# EAGLE design Adafruit Feather ESP32-S2 (EAGLE 9.6.2)
COMPANY: ADAFRUIT INDUSTRIES; DRAWN: KTOWN; REV: B
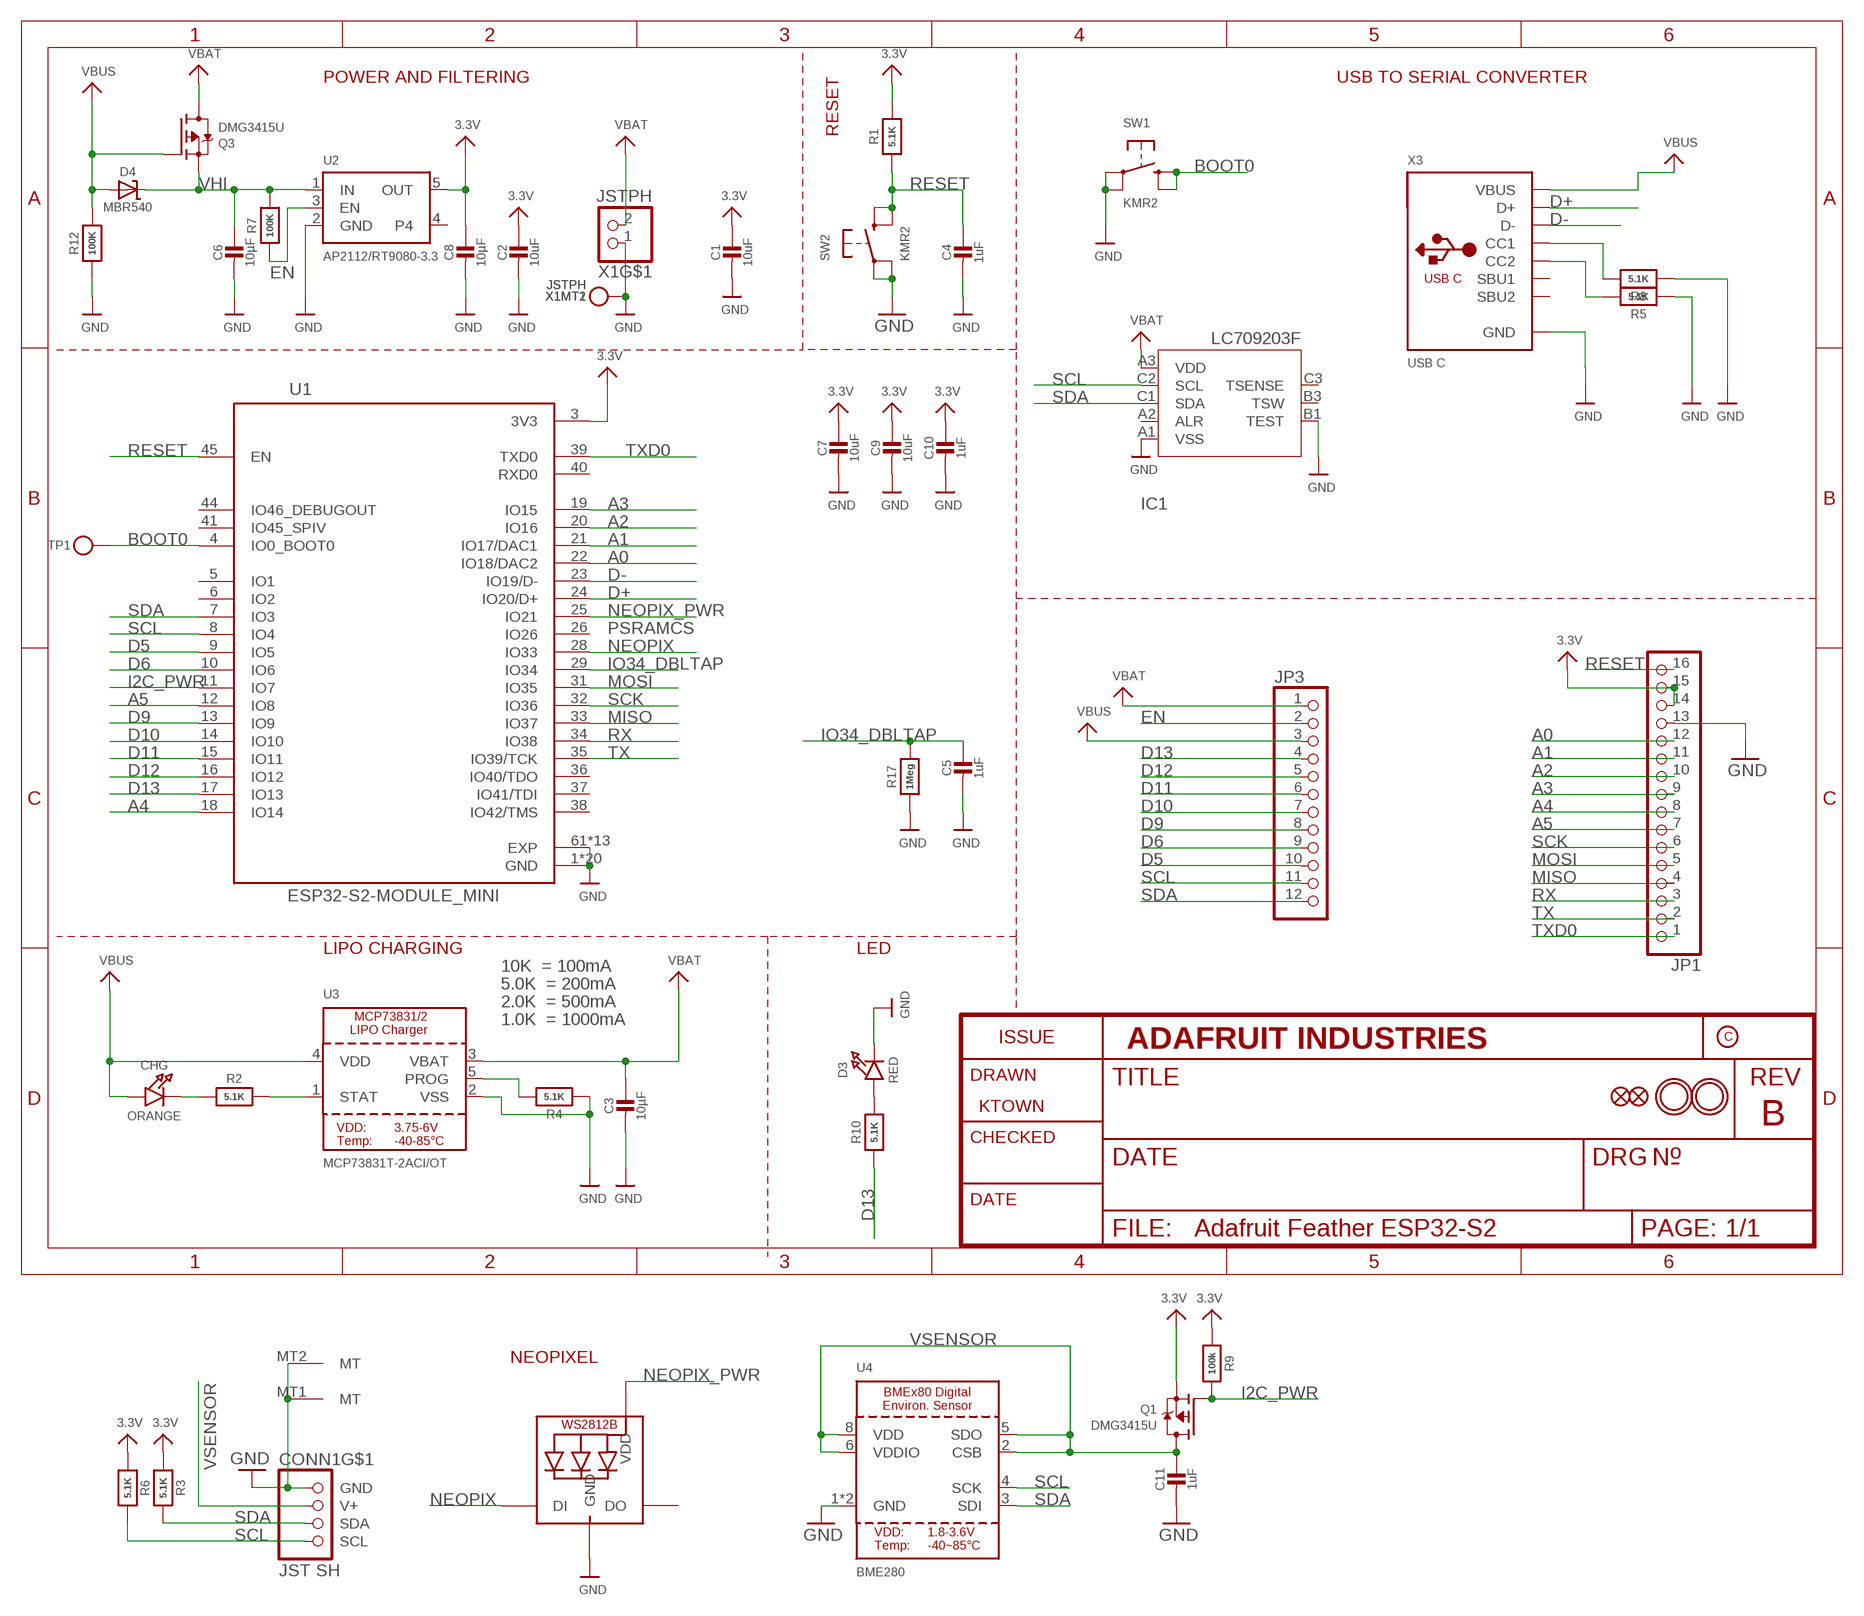
[diagram p0: schematic, sheet 1]

## Parts
C1  10uF  CAP_CERAMIC0805-NOOUTLINE  [0805-NO]
C2  10uF  CAP_CERAMIC0805-NOOUTLINE  [0805-NO]
C3  10µF  CAP_CERAMIC0805-NOOUTLINE  [0805-NO]
C4  1uF  CAP_CERAMIC0603_NO  [0603-NO]
C5  1uF  CAP_CERAMIC0603_NO  [0603-NO]
C6  10µF  CAP_CERAMIC0805-NOOUTLINE  [0805-NO]
C7  10uF  CAP_CERAMIC0805-NOOUTLINE  [0805-NO]
C8  10µF  CAP_CERAMIC0805-NOOUTLINE  [0805-NO]
C9  10uF  CAP_CERAMIC0805-NOOUTLINE  [0805-NO]
C10  1uF  CAP_CERAMIC0603_NO  [0603-NO]
C11  1uF  CAP_CERAMIC0603_NO  [0603-NO]
CHG  ORANGE  LED0603_NOOUTLINE  [CHIPLED_0603_NOOUTLINE]
CONN1  JST SH  STEMMA_I2C_QTRA  [JST_SH4_RA]
D3  RED  LED0603_NOOUTLINE  [CHIPLED_0603_NOOUTLINE]
D4  MBR540  DIODE-SCHOTTKYSOD-123  [SOD-123]
IC1  LC709203F/MH  [WLCSP9]
JP1  HEADER-1X16ROUND  [1X16_ROUND]
JP3  HEADER-1X12  [1X12_ROUND]
LED1  WS2812B_SK6805_1515  [SK6805_1515]
Q1  DMG3415U  MOSFET-P  [SOT23-R]
Q3  DMG3415U  MOSFET-P  [SOT23-R]
R1  5.1K  RESISTOR_0603_NOOUT  [0603-NO]
R2  5.1K  RESISTOR_0603_NOOUT  [0603-NO]
R3  5.1K  RESISTOR_0603_NOOUT  [0603-NO]
R4  5.1K  RESISTOR_0603_NOOUT  [0603-NO]
R5  5.1K  RESISTOR_0603_NOOUT  [0603-NO]
R6  5.1K  RESISTOR_0603_NOOUT  [0603-NO]
R7  100K  RESISTOR_0603_NOOUT  [0603-NO]
R8  5.1K  RESISTOR_0603_NOOUT  [0603-NO]
R9  100k  RESISTOR_0603_NOOUT  [0603-NO]
R10  5.1K  RESISTOR_0603_NOOUT  [0603-NO]
R12  100K  RESISTOR_0603_NOOUT  [0603-NO]
R17  1Meg  RESISTOR_0603_NOOUT  [0603-NO]
SW1  KMR2  SWITCH_TACT_SMT4.6X2.8  [BTN_KMR2_4.6X2.8]
SW2  KMR2  SWITCH_TACT_SMT4.6X2.8  [BTN_KMR2_4.6X2.8]
TP1  TESTPOINTROUND1.5MMNO  [TESTPOINT_ROUND_1.5MM_NO]
U1  ESP32-S2-MODULE_MINI  [QFN60_ESP32-S2-MINI-1_EXP]
U2  AP2112/RT9080-3.3  VREG_SOT23-5  [SOT23-5]
U3  MCP73831T-2ACI/OT  MCP73831/2  [SOT23-5]
U4  BME280  [BME280]
U$31  MOUNTINGHOLE2.5  [MOUNTINGHOLE_2.5_PLATED]
U$32  MOUNTINGHOLE2.5  [MOUNTINGHOLE_2.5_PLATED]
U$34  FIDUCIAL_1MM  [FIDUCIAL_1MM]
U$35  FIDUCIAL_1MM  [FIDUCIAL_1MM]
X1  JSTPH  CON_JST_PH_2PIN_MT_BATT  [JSTPH2_BATT]
X3  USB C  USB_C  [USB_C_CUSB31-CFM2AX-01-X]

## Nets
3.3V: C1.1 C2.1 C7.1 C8.1 C9.1 C10.1 JP1.14 JP1.15 Q1.2(S) R1.2 R3.1 R6.1 R9.2 U1.3(3V3) U2.5(OUT)
A0: JP1.12 U1.22(IO18/DAC2)
A1: JP1.11 U1.21(IO17/DAC1)
A2: JP1.10 U1.20(IO16)
A3: JP1.9 U1.19(IO15)
A4: JP1.8 U1.18(IO14)
A5: JP1.7 U1.12(IO8)
BOOT0: SW1.B'(S1) SW1.B(S) TP1.P$1 U1.4(IO0_BOOT0)
D5: JP3.10 U1.9(IO5)
D6: JP3.9 U1.10(IO6)
D9: JP3.8 U1.13(IO9)
D10: JP3.7 U1.14(IO10)
D11: JP3.6 U1.15(IO11)
D12: JP3.5 U1.16(IO12)
D13: JP3.4 R10.1 U1.17(IO13)
D+: U1.24(IO20/D+) X3.A6(D+) X3.B6(D+)
D-: U1.23(IO19/D-) X3.A7(D-) X3.B7(D-)
EN: JP3.2 R7.1 U2.3(EN)
GND: C1.2 C2.2 C3.2 C4.2 C5.2 C6.2 C7.2 C8.2 C9.2 C10.2 C11.2 CONN1.1(GND) CONN1.MT1(MT) CONN1.MT2(MT) D3.C IC1.A1(VSS) IC1.B1(TEST) JP1.13 LED1.4(GND) R4.1 R5.1 R8.1 R12.1 R17.1 SW1.A'(P1) SW1.A(P) SW2.A'(P1) SW2.A(P) U1.1(GND) U1.2(GND) U1.30(GND) U1.42(GND) U1.43(GND) U1.46(GND) U1.47(GND) U1.48(GND) U1.49(GND) U1.50(GND) U1.51(GND) U1.52(GND) U1.53(GND) U1.54(GND) U1.55(GND) U1.56(GND) U1.57(GND) U1.58(GND) U1.59(GND) U1.60(GND) U1.61(EXP) U1.62(EXP) U1.63(EXP) U1.64(EXP) U1.65(EXP) U1.66(EXP) U1.67(EXP) U1.68(EXP) U1.69(EXP) U1.70(EXP) U1.71(EXP) U1.72(EXP) U1.73(EXP) U2.2(GND) U3.2(VSS) U4.1(GND) U4.7(GND) X1.1 X1.NC1 X1.NC2 X3.A1B12(GND) X3.B1A12(GND)
I2C_PWR: Q1.1(G) R9.1 U1.11(IO7)
IO34_DBLTAP: C5.1 R17.2 U1.29(IO34)
MISO: JP1.4 U1.33(IO37)
MOSI: JP1.5 U1.31(IO35)
N$1: CHG.C R2.1
N$3: R2.2 U3.1(STAT)
N$4: R4.2 U3.5(PROG)
N$5: D3.A R10.2
N$8: R8.2 X3.A5(CC1)
N$9: R5.2 X3.B5(CC2)
NEOPIX: LED1.1(DI) U1.28(IO33)
NEOPIX_PWR: LED1.2(VDD) U1.25(IO21)
RESET: C4.1 JP1.16 R1.1 SW2.B'(S1) SW2.B(S) U1.45(EN)
RX: JP1.3 U1.34(IO38)
SCK: JP1.6 U1.32(IO36)
SCL: CONN1.4(SCL) IC1.C2(SCL) JP3.11 R6.2 U1.8(IO4) U4.4(SCK)
SDA: CONN1.3(SDA) IC1.C1(SDA) JP3.12 R3.2 U1.7(IO3) U4.3(SDI)
TX: JP1.2 U1.35(IO39/TCK)
TXD0: JP1.1 U1.39(TXD0)
VBAT: C3.1 IC1.A3(VDD) JP3.1 Q3.3(D) U3.3(VBAT) X1.2
VBUS: CHG.A D4.A JP3.3 Q3.1(G) R12.2 U3.4(VDD) X3.A4B9(VBUS) X3.B4A9(VBUS)
VHI: C6.1 D4.C Q3.2(S) R7.2 U2.1(IN)
VSENSOR: C11.1 CONN1.2(V+) Q1.3(D) U4.2(CSB) U4.5(SDO) U4.6(VDDIO) U4.8(VDD)
Unconnected: IC1.A2(ALR) IC1.B3(TSW) IC1.C3(TSENSE) LED1.3(DO) U1.5(IO1) U1.6(IO2) U1.26(IO26) U1.36(IO40/TDO) U1.37(IO41/TDI) U1.38(IO42/TMS) U1.40(RXD0) U1.41(IO45_SPIV) U1.44(IO46_DEBUGOUT) U2.4 X3.A8(SBU1) X3.B8(SBU2)

## Notes on the sheet
- POWER AND FILTERING | USB TO SERIAL CONVERTER
- RESET
- PSRAMCS
- LIPO CHARGING | LED
- 10K  = 100mA
- 5.0K  = 200mA
- 2.0K  = 500mA
- 1.0K  = 1000mA
- NEOPIXEL

## Library data of the parts
C1-C7 C9-C11 = microbuilder:CAP_CERAMIC: Ceramic Capacitors For new designs, use the packages preceded by an '_' character since they are more reliable: The following footprints should be used on most boards: _0402 - Standard footprint for regular board layouts _0603 - Standard footprint for regular board layouts _0805 - Standard footprint for regular board layouts _1206 - Standard footprint for regular board layouts For extremely tight-pitch boards where space is at a premium, the following 'micro-pitch' footprints can be used (smaller pads, no silkscreen outline, etc.): _0402MP - Micro-pitch footprint for very dense/compact boards _0603MP - Micro-pitch footprint for very dense/compact boards _0805MP - Micro-pitch footprint for very dense/compact boards _1206MP - Micro-pitch footprint for very dense/compact boards
C8 = microbuilder:CAP_CERAMIC: Ceramic Capacitors For new designs, use the packages preceded by an '_' character since they are more reliable: The following footprints should be used on most boards: _0402 - Standard footprint for regular board layouts _0603 - Standard footprint for regular board layouts _0805 - Standard footprint for regular board layouts _1206 - Standard footprint for regular board layouts For extremely tight-pitch boards where space is at a premium, the following 'micro-pitch' footprints can be used (smaller pads, no silkscreen outline, etc.): _0402MP - Micro-pitch footprint for very dense/compact boards _0603MP - Micro-pitch footprint for very dense/compact boards _0805MP - Micro-pitch footprint for very dense/compact boards _1206MP - Micro-pitch footprint for very dense/compact boards; REV: B
CHG D3 = microbuilder:LED: LED 0603 - 0603 Surface Mount Package 2mA: Green LED - Low Power (3.9mcd, 2ma, 1.7Vf) - Digikey: 475-2709-2-ND Orange LED - Low Power (9.8mcd, 2ma, 1.8Vf) - Digikey: 475-1194-2-ND Red LED - Low Power (5mcd, 2ma, 1.8Vf) - Digikey: 475-1195-2-ND Yellow LED - Low Power (7mcd, 2ma, 1.8Vf) - Digikey: 475-1196-2-ND 5mA: Blue LED - Low Power (17mcd, 5ma, 2.9Vf) - Digikey: LNJ937W8CRACT-ND 0805 - 0805 Surface Mount Package 2mA: Red LED (8.8mcd, 2mA, 1.8Vf, Clear) - Low Power [Digikey: 475-2510-1-ND] Green LED (5mcd, 2mA, 1.8Vf, Clear) - Low Power [Digikey: 475-2730-1-ND] Yellow LED (11.3mcd, 2mA, 1.8Vf, Clear) - Low Power [Digikey: 475-2555-1-ND] 20mA: Red LED (104mcd, 20mA, Diffused) - LS R976 [Digikey: 475-1278-6-ND] Red LED (12mcd, 20mA, 2.0Vf, Clear) - APT2012EC [Digikey: 754-1128-1-ND] Green LED (15mcd, 20mA, 2.2Vf, Clear) - APT2012GC [Digikey: 754-1131-1-ND] Orange LED (160mcd, 20mA, 2.1Vf, Clear) - APT2012SECK [Digikey: 754-1130-1-ND] 1206 - 1206 Surface Mount Package Green LED (26mcd, 20mA, Diffused) - LG N971 [Digikey: 475-1407-6-ND] Red LED (15mcd, 20mA, Diffused) - LH N974 [Digikey: 475-1416-6-ND] Cree - Cree High-Power Surface Mount LEDs XPEBWT-L1-0000-00D50 - White 111lm 350mA 2.9Vf 6200K 110° XTEAWT-00-0000-00000LEE3 - White 114lm 350mA 2.85Vf 5000K 115° Everlight - Everlight 45-21 Series Surface Mount LEDs 45-21/QK2C-B2832AC2CB2/2T - Warm White 2000mcd 20mA 3.25Vf 3050K 120° 45-21/LK2C-B38452C4CB2/2T - Nuetral White 2000mcd 20mA 3.25Vf 4150K 120° 45-21/LK2C-B50634C6CB2/2T - Cold White 2200mcd 20mA 3.25Vf 5650K 120° PLCC2 Reverse Mount LS T77K-J1L2-1-0-2-R18-Z - Red 11.25mcd 2mA 1.8Vf 630nm 120° LO T77K-L1M2-24-Z - Orange 19.6mcd 2mA 1.8Vf 606nm 120° LY T77K-K2M1-26-Z - Yellow 15.7mcd 2mA 1.8Vf 587nm 120°
CONN1 = microbuilder:STEMMA_I2C
D4 = microbuilder:DIODE-SCHOTTKY
IC1 = adafruit_sensor:LC709203F
JP1 = microbuilder:HEADER-1X16: PIN HEADER
JP3 = microbuilder:HEADER-1X12
LED1 = microbuilder:WS2812B
Q1 Q3 = microbuilder:MOSFET-P: P-Channel Mosfet LEGEND VDS: Voltage Drain-Source ID: Drain Current RDS(ON): Drain-Source On-State Resistance VGS(TH): Gate-Source Threshold Voltage CISS: Drain-Source Input Capacitance SOT-23 Name VDS ID RDS(ON) VGS(TH) CISS Order Number IRLML5103 30V 760mA 600 mOhm -- 75pF @ 25V Digikey: IRLML5103PBFCT-ND IRLML6401 12V 4.3A 50 mOhm 950mV @ 250µA 830pF @ 10V Digikey: IRLML6401PBFTR-ND NTR0202PL 20V 400mA 800 mOhm 2.3V @ 250uA 70pF @ 5V Digikey: NTR0202PLT1GOSTR-ND NTR4101PT1G 20V 1.8A 85 mOhm 1.2V @ 250uA 675pF @ 10V Digikey: NTR4101PT1GOSCT-ND DMP2004K 20V 600mA 900 mOhm 1V @ 250uA 175pF @ 16V Digikey: DMP2004KDICT-ND PMV65XP 20V 3.9A 76 mOhm 950mV @ 1mA 725pF @ 20V Digikey: 568-2358-2-ND TO-252 Name VDS ID RDS(ON) VGS(TH) CISS Order Number AOD417 30V 25A 34 mOhm 3V @ 250µA 920pF @ 15V Digikey: 785-1106-2-ND PowerPak Name VDS ID RDS(ON) VGS(TH) CISS Order Number AON7401 30V 12A 14 mOhm 3V @ 250µA 2600pF @ 15V Digikey: 785-1302-1-ND
R1-R10 R12 R17 = microbuilder:RESISTOR: Resistors For new designs, use the packages preceded by an '_' character since they are more reliable: The following footprints should be used on most boards: _0402 - Standard footprint for regular board layouts _0603 - Standard footprint for regular board layouts _0805 - Standard footprint for regular board layouts _1206 - Standard footprint for regular board layouts For extremely tight-pitch boards where space is at a premium, the following 'micro-pitch' footprints can be used (smaller pads, no silkscreen outline, etc.): _0402MP - Micro-pitch footprint for very dense/compact boards _0603MP - Micro-pitch footprint for very dense/compact boards _0805MP - Micro-pitch footprint for very dense/compact boards _1206MP - Micro-pitch footprint for very dense/compact boards
SW1 SW2 = microbuilder:SWITCH_TACT_SMT: SMT Tact Switches 6x6mm - Digikey: P12940SCT-ND KMR2 (4.6x2.8mm) - Digikey: 401-1426-1-ND EVQ-PQHB55 - Light Touch, 160GF (4.5x4.5mm) - Digikey: P8090SCT-ND KMT0 - KMT021 NGJ LHS (etc.) IP68/Waterproof - Digikey: CKN10289CT-ND
TP1 = microbuilder:TESTPOINT: Test Point Various test points for characterisation and PCB testing TESTPOINT_SMT - Compact Surface Mount Test Point [Digikey: 5016KTR-ND]
U1 = adafruit_wireless:ESP32-S2-MODULE: WiFi 802.11b/g/n Transceiver Module 2.4GHz Antenna Not Included Surface Mount Check prices <https://snapeda.com/parts/ESP32-S2-WROVER/Espressif%20Systems/view-part/?ref=eda>
U2 = microbuilder:VREG_SOT23-5: SOT23-5 Fixed Voltage Regulators Part Current Out V Out V In V Dropout θJA (°C/W) TJ (°C) Digikey Part No. ADP121 150mA 3.3V 3.4-5.5V 0.09V @ 150mA -- -- ADP121-AUJZ33R7CT-ND ADP121 150mA 3.0V 3.1-5.5V 0.09V @ 150mA -- -- ADP121-AUJZ30R7CT-ND ADP122 300mA 3.3V 3.4-5.5V 0.085V @ 300mA -- -- ADP122AUJZ-3.3-R7CT-ND ADP1712 300mA 3.3V 3.5-5.5V 0.17V @ 300mA -- -- ADP1712AUJZ-3.3-R7TR-ND AP7311 (Low Cost) 150mA 3.3V 3.5-6V 0.15V @ 150mA -- -- AP7311-33WG-7DICT-ND LD39015M18R 150mA 1.8V 1.9V-5.5V 0.08V @ 100mA -- -- 497-6977-1-ND LP2985A-33DBVR 150mA 3.3V 3.3-16V 0.28V @ 150mA 206 150 296-18479-1-ND MCP1824T-3302E/OT 300mA 3.3V 3.5V-6V 0.2V @ 300mA -- -- MCP1824T-3302E/OTCT-ND MIC5205-2.5YM5 TR 150mA 2.5V 2.7-16V 0.165V @ 150mA -- -- 576-1257-2-ND MIC5205-3.0YM5 TR 150mA 3.0V 3.2V-16V 0.165V @ 150mA -- -- 576-1258-2-ND MIC5205-3.3YM5 TR 150mA 3.3V 3.5V-16V 0.165V @ 150mA -- -- 576-1259-2-ND TPS780330220 150mA 3.3V+2.2V 3.6-5.5V 250mV Max -- -- 296-23332-1-ND TDA3663/N1,135 100mA 3.3V 3.5-45V 0.18V @ 50mA -- -- 568-5343-1-ND Max operating temp can be calculated using θJA, TJ (max junction temperature), and power in watts. Set the "Maximum Ambient Temperature" until it reaches TJ ("Max Junction Temperature"), which is the absolute limit for safe use of the regulator: Heat Sink Temperature Calculator <http://www.daycounter.com/Calculators/Heat-Sink-Temperature-Calculator.phtml> For example, With 12V source into a 3.3V LP2985 and a 30mA load, we are dissipating (12V-3.3V) * 0.03A = 0.261W. With a θJA of 206 °C/W, a TJ of 150°C, and 261mW we can safely use the chip without a heat sink up to 75°C (=147.1°C Junction Temperature).
U3 = microbuilder:MCP73831/2: MCP73831/2 LIPO Charger VDD: 3.75 - 6V Temp -40 - 85°C Programmable Charge Rate: 15-500mA NOTE: STAT is a tri-state logic output on the MCP73831 and an open-drain output on the MCP73832. SOT23-5 with 4.2V output and tri-state logic on STAT = MCP73831T-2ACI/OT
U4 = adafruit_sensor:BME280: BME280 - Environmental Sensor (I2C + SPI)
U$31 U$32 = microbuilder:MOUNTINGHOLE: Mounting Hole For #2 screws (0.086"/2.18mm width, 0.094"/2.4mm hole) use 2.5mm; BOM: EXCLUDE
U$34 U$35 = microbuilder:FIDUCIAL: Fiducial Alignment Points Various fiducial points for machine vision alignment.; BOM: EXCLUDE
X1 = adafruit_electromech:CON_JST_PH_2PIN_MT
X3 = adafruit_connector:USB_C: USB Type-C USB 2.0 Connector

## Net classes
2 gnd: width 0.254 mm, drill 0.483 mm
3 Power: width 0.305 mm, drill 0.483 mm

## Board
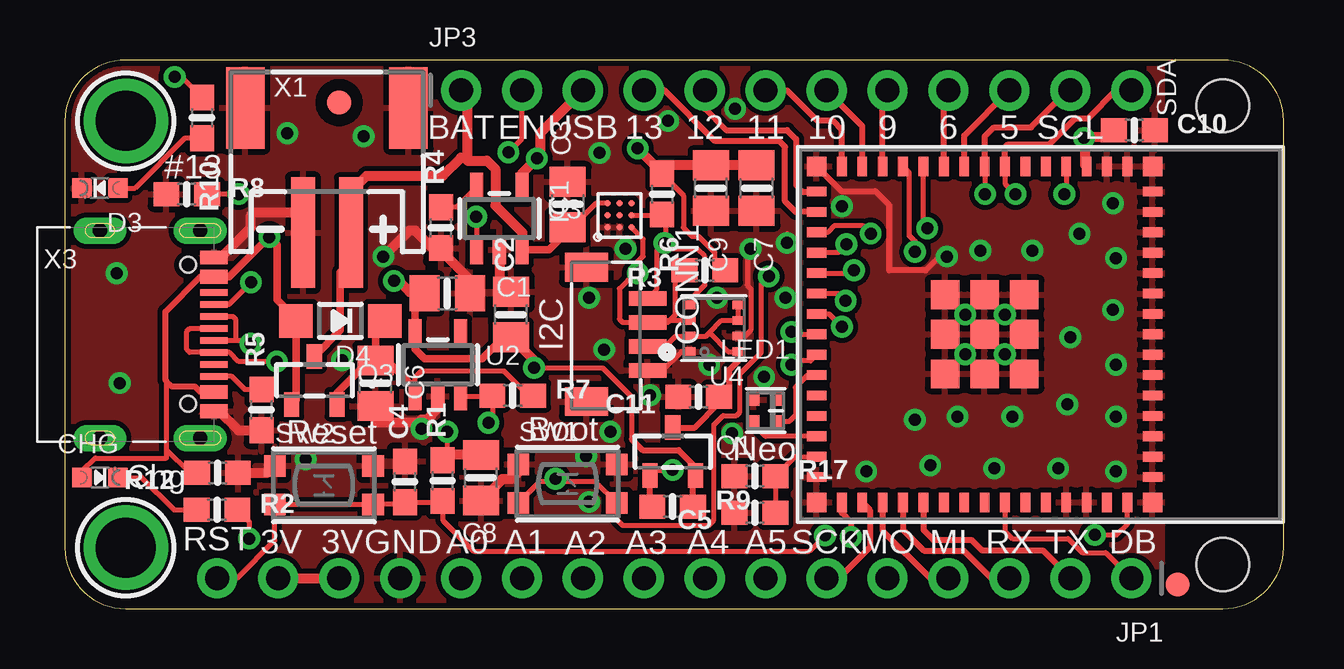
[diagram p1: board, top side]
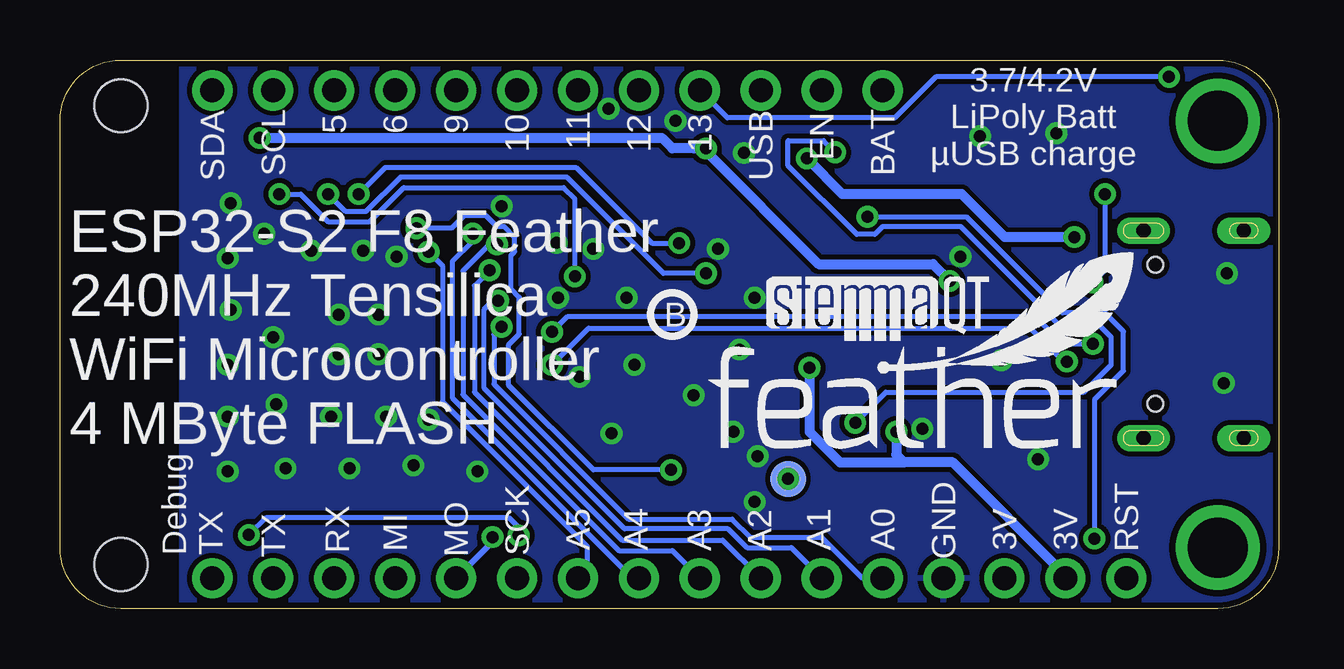
[diagram p2: board, bottom side, seen from below]

Size 50.8 x 22.86 mm. Coordinates in mm from the lower left corner, seen from the top.
Outline: 2.54,0 48.26,0 arc90 50.8,2.54 50.8,20.32 arc90 48.26,22.86 2.54,22.86 arc90 0,20.32 0,2.54 arc90 2.54,0
Copper layers (1*16): Top 0.035mm / dielectric 1.5mm / Bottom 0.035mm
Design rules "adafruit 7-7 *": minimum track width 6mil, minimum drill 15.5mil, track to track 8mil, track to pad 7mil, pad to pad 7mil, via to via 7mil, smd to smd 7mil, copper to edge 10mil, drill to drill 8mil, minimum pad ring 10mil, minimum via ring 8mil, stop-mask expansion 2mil, vias tented up to drill 20mil, thermal gap 10mil
Holes 2.2 mm at 48.26,1.84 48.26,20.95

### Footprints (pad centres in the part's own frame; a part is rotated, then mirrored left to right if it is on the bottom)
0805-NO = smd 1.24 x 1.5: 1 -0.95,0; 2 0.95,0
0603-NO = smd 1.075 x 1: 1 -0.85,0; 2 0.85,0
CHIPLED_0603_NOOUTLINE = smd 0.8 x 0.8: A 0,-0.75; C 0,0.75
JST_SH4_RA = smd 0.6 x 1.55: 1 1.5,1.686; 2 0.5,1.686; 3 -0.5,1.686; 4 -1.5,1.686 | smd 1.2 x 1.8: MT1 -2.8,-0.862; MT2 2.8,-0.862
SOD-123 = smd 1.4 x 1.4: A 1.85,0; C -1.85,0
WLCSP9 = smd 0.275 x 0.275: A1 -0.5,0.5; A2 0,0.5; A3 0.5,0.5; B1 -0.5,0; B2 0,0; B3 0.5,0; C1 -0.5,-0.5; C2 0,-0.5; C3 0.5,-0.5
1X16_ROUND = drill 1 pad 1.676: 1 -19.05,0; 2 -16.51,0; 3 -13.97,0; 4 -11.43,0; 5 -8.89,0; 6 -6.35,0; 7 -3.81,0; 8 -1.27,0; 9 1.27,0; 10 3.81,0; 11 6.35,0; 12 8.89,0; 13 11.43,0; 14 13.97,0; 15 16.51,0; 16 19.05,0
1X12_ROUND = drill 1 pad 1.676: 1 -13.97,0; 2 -11.43,0; 3 -8.89,0; 4 -6.35,0; 5 -3.81,0; 6 -1.27,0; 7 1.27,0; 8 3.81,0; 9 6.35,0; 10 8.89,0; 11 11.43,0; 12 13.97,0
SK6805_1515 = smd 0.5 x 0.5: 1 -0.5,-0.45; 2 0.5,-0.45; 3 0.5,0.45; 4 -0.5,0.45
SOT23-R = smd 0.635 x 1.016: 1 -0.95,-1; 2 0.95,-1; 3 0,1
BTN_KMR2_4.6X2.8 = smd 0.9 x 0.9: A 2.05,0.8; A' -2.05,0.8; B 2.05,-0.8; B' -2.05,-0.8
TESTPOINT_ROUND_1.5MM_NO = smd 1.5 x 1.5: P$1 0,0
QFN60_ESP32-S2-MINI-1_EXP = smd 0.813 x 0.406: 1 -7,3.645; 2 -7,2.795; 3 -7,1.945; 4 -7,1.095; 5 -7,0.245; 6 -7,-0.605; 7 -7,-1.455; 8 -7,-2.305; 9 -7,-3.155; 10 -7,-4.005; 11 -7,-4.855; 12 -7,-5.705; 13 -7,-6.555; 14 -7,-7.405; 15 -7,-8.255; 31 7,-8.255; 32 7,-7.405; 33 7,-6.555; 34 7,-5.705; 35 7,-4.855; 36 7,-4.005; 37 7,-3.155; 38 7,-2.305; 39 7,-1.455; 40 7,-0.605; 41 7,0.245; 42 7,1.095; 43 7,1.945; 44 7,2.795; 45 7,3.645 | smd 0.406 x 0.813: 16 -5.95,-9.305; 17 -5.1,-9.305; 18 -4.25,-9.305; 19 -3.4,-9.305; 20 -2.55,-9.305; 21 -1.7,-9.305; 22 -0.85,-9.305; 23 0,-9.305; 24 0.85,-9.305; 25 1.7,-9.305; 26 2.55,-9.305; 27 3.4,-9.305; 28 4.25,-9.305; 29 5.1,-9.305; 30 5.95,-9.305; 46 5.95,4.695; 47 5.1,4.695; 48 4.25,4.695; 49 3.4,4.695; 50 2.55,4.695; 51 1.7,4.695; 52 0.85,4.695; 53 0,4.695; 54 -0.85,4.695; 55 -1.7,4.695; 56 -2.55,4.695; 57 -3.4,4.695; 58 -4.25,4.695; 59 -5.1,4.695; 60 -5.95,4.695 | smd 1.194 x 1.194: 61 0,-2.305; 66 -1.65,-0.655; 67 0,-0.655; 68 1.65,-0.655; 69 -1.65,-2.305; 70 1.65,-2.305; 71 -1.65,-3.955; 72 0,-3.955; 73 1.65,-3.955 | smd 0.813 x 0.813: 62 -7,4.695; 63 -7,-9.305; 64 7,-9.305; 65 7,4.695
SOT23-5 = smd 0.55 x 1.2: 1 -0.95,-1.3; 2 0,-1.3; 3 0.95,-1.3; 4 0.95,1.3; 5 -0.95,1.3
BME280 = smd 0.5 x 0.35: 1 1.025,0.975; 2 1.025,0.325; 3 1.025,-0.325; 4 1.025,-0.975; 5 -1.025,-0.975; 6 -1.025,-0.325; 7 -1.025,0.325; 8 -1.025,0.975
MOUNTINGHOLE_2.5_PLATED = drill 2.5 pad 3.2: P$1 0,0
FIDUCIAL_1MM = smd 1 x 1: 1 0,0
JSTPH2_BATT = smd 1 x 4.6: 1 -1,-3.7; 2 1,-3.7 | smd 1.6 x 3.4: NC1 -3.4,1.5; NC2 3.4,1.5
USB_C_CUSB31-CFM2AX-01-X = smd 0.575 x 1.15: A1B12 -3.2,3.545; A4B9 -2.4,3.545; B1A12 3.2,3.545; B4A9 2.4,3.545 | smd 0.275 x 1.15: A5 -1.25,3.545; A6 -0.25,3.545; A7 0.25,3.545; A8 1.25,3.545; B5 1.75,3.545; B6 0.75,3.545; B7 -0.75,3.545; B8 -1.75,3.545 | drill 0.6 pad 1 long: M1 -4.32,2.97; M2 4.32,2.97; M3 -4.32,-1.21; M4 4.32,-1.21 | hole 0.65: 2.89,2.47; -2.89,2.47

### Placement (x,y rotation side)
C1  15.94,13.13 0 top
C2  18.59,12.26 90 top
C3  20.95,16.84 90 top
C4  14.17,5.28 90 top
C5  28.77,4 180 top
C6  12.94,9.39 270 top
C7  28.83,17.53 270 top
C8  17.34,5.45 270 top
C9  26.92,17.53 270 top
C10  44.58,19.94 0 top
C11  26.42,8.83 180 top
CHG  1.46,5.46 270 top
CONN1  22.61,11.43 270 top
D3  1.46,17.53 90 top
D4  11.48,11.99 180 top
IC1  23.11,16.38 90 top
JP1  25.4,1.27 180 top
JP3  30.48,21.59 0 top
LED1  29.21,8.26 0 top
Q1  25.34,6.54 0 top
Q3  10.4,9.51 0 top
R1  15.75,5.33 90 top
R2  6.34,4.11 0 top
R3  26.67,14.1 180 top
R4  15.67,15.88 90 top
R5  8.19,8.28 90 top
R6  24.89,17.27 270 top
R7  18.67,8.88 0 top
R8  5.08,17.27 0 top
R9  25.34,4.25 0 top
R10  5.71,20.45 270 top
R12  6.36,5.66 180 top
R17  28.77,5.52 0 top
SW1  20.95,5.21 0 top
SW2  10.79,5.14 0 top
TP1  20.45,5.41 0 bottom
U1  40.64,11.43 270 top
U2  15.54,10.16 0 top
U3  18.11,16.26 0 top
U4  27.05,11.68 180 top
U$14  [PCBFEAT-REV-040]  25.27,12.26 0 bottom
U$15  [FEATHERLOGO_MED]  23.88,6.6 0 bottom
U$31  2.54,20.32 270 top
U$32  2.54,2.54 270 top
U$34  11.43,21.08 270 top
U$35  46.38,1 270 top
U$53  [STEMMAQT]  21.34,11.18 0 bottom
X1  10.92,19.37 0 top
X3  2.67,11.43 270 top

### Tracks (layer width: path | path; a pad name or v marks a point on that pad's centre or on a via)
3.3V  (via drill 0.5)
  Top 0.203: v15.94,7.37 15.94,6.38 R1.2 | v19.56,10.03 22.42,10.03 23.62,8.83 23.62,7.06 | v23.88,19.18 24.88,18.17 24.89,18.17 R6.1 25.78,17.23 25.78,15.88 26.15,15.51 26.41,15.51 27.08,14.85 27.08,14.54 R3.1
  Top 0.254: R9.2 26.19,5.44 Q1.2 26.29,5.9 25.58,6.6 24.08,6.6 23.62,7.06
  Top 0.305: C1.1 14.6,12.74 U2.5 14.6,10.8 14.99,10.41 17.4,10.41 18.29,11.31 C2.1
  Top 0.406: 42.52,19.61 42.52,18.49 U1.3 | v42.48,19.61 42.52,19.61 | 42.52,19.61 42.52,19.64 43.42,19.64 C10.1 | C1.1 14.93,13.2 14.36,13.2 13.91,13.65 v13.72,13.65 | C7.1 C9.1 24.58,18.48 v23.88,19.18 | v19.56,10.03 19.56,10.34 C2.1 | JP1.15 JP1.14 | C8.1 15.97,6.4 R1.2
  Bottom 0.203: 24.38,19.18 v23.88,19.18 23.88,19.05
  Bottom 0.406: v42.48,19.61 25.71,19.61 25.27,19.18 24.38,19.18 | 23.88,19.05 19.18,14.35 14.41,14.35 v13.72,13.65 | v19.56,10.03 19.56,7.37 18.29,6.1 15.62,6.1 | v15.94,7.37 15.94,6.41 15.62,6.1 | JP1.15 8.89,1.4 13.59,6.1 15.62,6.1
A0  (via drill 0.5)
  Top 0.203: U1.22 31.85,12.28 v32.39,11.74
  Bottom 0.203: v32.39,11.74 32.72,11.42 32.72,9.35 27.09,3.73 22.78,3.73 22.02,2.97 19.05,2.97 17.35,1.27 JP1.12
A1  (via drill 0.5)
  Top 0.203: v32.54,12.83 32.24,13.13 U1.21
  Bottom 0.203: JP1.11 20.32,2.54 22.16,2.54 22.95,3.33 27.26,3.33 33.12,9.19 33.12,12.47 32.77,12.83 v32.54,12.83
A2  (via drill 0.5)
  Top 0.203: U1.20 32.78,13.98 v32.89,14.1
  Bottom 0.203: v32.89,14.1 33.53,13.46 33.53,9.02 27.37,2.86 23.18,2.86 JP1.10
A3  (via drill 0.5)
  Top 0.203: v32.58,15.18 32.23,14.83 U1.19
  Bottom 0.203: JP1.9 25.27,2.41 27.5,2.41 34.01,8.92 34.01,14.07 32.9,15.18 v32.58,15.18
A4  (via drill 0.5)
  Top 0.203: U1.18 31.8,15.68 32.06,15.94 33.27,15.94 v33.59,15.63
  Bottom 0.203: v33.59,15.63 33.59,15.34 34.46,14.47 34.46,8.79 26.93,1.27 JP1.8
A5  (via drill 0.5)
  Top 0.203: v35.43,14.87 35.43,15.31 35.19,15.56 35.19,18.18 U1.12
  Bottom 0.203: v35.43,14.87 34.86,14.3 34.86,8.63 28.83,2.59 28.83,1.65 JP1.7
BOOT0  (via drill 0.5)
  Top 0.203: 20.7,5.3 19.79,5.3 SW1.B' | 20.7,5.3 22.12,5.3 SW1.B 23,3.71 23.26,3.45 26.82,3.45 27.05,3.68 27.05,7.67 27.43,8.05 27.99,8.05 28.13,8.19 28.13,9.78 29.02,10.67 29.02,13.53 v29.34,13.84 | U1.4 41.73,17.35 v41.66,17.27 | TP1.P$1 20.59,5.41 20.7,5.3
  Bottom 0.203: v41.66,17.27 40.77,17.27 39.62,16.13 37.89,16.13 36.47,17.55 29.8,17.55 29.34,17.08 v29.34,13.84
  other vias: 20.45,5.41
D5
  Top 0.254: U1.9 37.48,19.7 JP3.10
D6
  Top 0.254: U1.10 36.63,21.39 JP3.9
D9
  Top 0.254: U1.13 34.09,21.39 JP3.8
D10
  Top 0.254: U1.14 33.23,20.11 JP3.7
D11
  Top 0.254: U1.15 32.38,19.94 32,20.32 31.37,20.32 30.1,21.59 JP3.6
D12
  Top 0.254: JP3.5 26.67,20.83 27.56,19.94 30.1,19.94 30.48,19.56 30.48,17.65 30.75,17.38 U1.16
D13  (via drill 0.5)
  Top 0.203: R10.1 4.86,22.15 v4.57,22.15
  Top 0.254: U1.17 30.46,16.53 30.02,16.97 30.02,19.24 29.78,19.48 27.11,19.48 25,21.59 JP3.4
  Bottom 0.203: v4.57,22.15 14.3,22.15 16,20.45 22.99,20.45 JP3.4
D+  (via drill 0.5)
  Top 0.203: U1.24 31.08,10.33 30.46,10.33 v30.29,10.16 | v8.84,10.3 7.25,10.3 6.87,10.68 X3.B6 5.2,10.68 5.08,10.79 5.08,11.56 5.2,11.68 X3.A6
  Bottom 0.203: v30.29,10.16 28.77,11.68 10.35,11.68 8.96,10.3 v8.84,10.3
D-  (via drill 0.5)
  Top 0.203: X3.A7 7.11,11.18 | 7.11,11.18 7.61,11.18 v7.75,11.04 | v30.29,11.53 30.39,11.43 U1.23 | X3.B7 7,12.18 7.11,12.06 7.11,11.18
  Bottom 0.203: v30.29,11.53 29.64,12.18 10.16,12.18 9.02,11.04 v7.75,11.04
EN  (via drill 0.5)
  Top 0.203: U2.3 17.8,8.86 R7.1 17.82,7.91 v17.65,7.75 | v18.48,19.02 19.05,19.58 JP3.2
  Bottom 0.203: v17.65,7.75 16.38,9.02 8.13,9.02 6.99,10.16 6.99,11.31 7.44,11.77 9.1,11.77 13.25,15.92 16.52,15.92 16.84,15.59 17.59,15.59 20.45,18.45 20.45,19.5 18.97,19.5 v18.48,19.02
GND  (via drill 0.5)
  Top 0.203: CONN1.1 24.92,9.93 25.7,10.71 U4.1 | U4.7 28.35,11.36 28.61,11.62 28.61,13.3 28.48,13.43 28.48,13.46 28.45,13.49 28.45,14.86 v28.57,14.99 | 30.1,15.62 v30.1,15.24
  Top 0.254: U1.63 32.37,17.4 33.78,17.4 34.35,16.83 34.35,14.1 35.88,14.1 36.61,14.83 v36.77,14.67
  Top 0.406: X3.B1A12 6.44,8.23 7.24,7.43 R5.1 | X3.A1B12 6.5,14.63 7.69,15.82 7.69,15.83 7.75,15.89 7.75,16.38 7.87,16.51 9.65,16.51 9.92,16.24 X1.1 | C1.2 16.89,13.7 15.67,14.92 R4.1 15.33,15.03 14.61,15.75 14.35,15.75 v13.27,14.67 | SW1.A' 18.91,5.68 18.63,5.4 18.24,5.4 C8.2 | U2.2 15.54,8.33 15.09,7.88 14.86,7.88 14.73,7.75 12.94,7.75 C6.2 | U3.2 18.11,13.69 C2.2 | R12.1 8.47,5.66 SW2.A'
  other vias: 29.15,9.65 33.4,5.71 43.81,5.71 43.81,8 43.81,10.16 43.69,12.45 43.81,14.61 43.69,16.89 42.29,15.62 40.32,14.92 38.16,14.92 35.43,7.87 36.07,5.97 38.73,5.84 41.4,5.84 41.91,11.3 41.78,8.51 39.5,8 37.21,8 22.73,7.37 21.72,6.35 21.84,12.95 11.56,10.35 10.03,6.22 2.16,13.97 2.29,9.4 9.27,19.81 12.45,19.68 23.37,14.99 25.15,20.32 27.94,20.83 21.84,4.45 22.48,10.79 30.04,12.95 32.38,16.76 26.86,10.16 27.18,12.95 24.38,8.89 22.29,18.99 14.86,7.49 27.81,7.3 39.18,10.6 39.18,12.26 37.53,12.26 37.53,10.6
  pour Top: 0,22.86 45.72,22.86 45.72,0 0,0
  pour Bottom: 0,22.86 45.72,22.86 45.72,0 0,0
I2C_PWR  (via drill 0.5)
  Top 0.203: v35.94,15.85 35.78,16.01 U1.11
  Top 0.254: R9.1 24.39,4.35 Q1.1 24.62,5.78 v25.34,5.78
  Bottom 0.203: v25.34,5.78 28.57,5.78 32.09,9.31 32.09,11 31.66,11.44 31.66,12.98 32,13.33 32,14.72 31.85,14.88 31.85,15.48 32.28,15.91 32.58,15.91 33.05,16.38 33.95,16.38 34.48,15.85 v35.94,15.85
IO34_DBLTAP
  Top 0.203: C5.1 R17.2 30.42,6.33 U1.29
MISO
  Top 0.254: U1.33 34.09,3.25 36.07,1.27 JP1.4
MOSI  (via drill 0.5)
  Top 0.254: U1.31 32.38,3.99 32.77,3.6 v32.77,2.98
  Bottom 0.254: v32.77,2.98 32.77,2.79 JP1.5
N$1
  Top 0.203: R2.1 4.55,4.12 3.2,5.46 CHG.C
N$3  (via drill 0.5)
  Top 0.203: v17.14,16.32 17.16,16.31 U3.1 | R2.2 7.68,3.62 v7.68,2.92
  Bottom 0.203: v17.14,16.32 13.02,16.32 9.02,12.32 7.24,12.32 6.48,11.56 6.48,9.91 7.68,8.7 v7.68,2.92
N$4
  Top 0.203: U3.5 16.33,16.73 R4.2
N$5
  Top 0.203: D3.A 2.92,17.53 4.99,19.6 R10.2
N$8  (via drill 0.5)
  Top 0.203: X3.A5 6.84,12.68 v7.76,13.6 | v7.24,17.27 R8.2
  Bottom 0.203: v7.24,17.27 v7.25,17.26 7.25,14.11 v7.76,13.6
N$9
  Top 0.203: X3.B5 6.96,9.68 7.51,9.13 R5.2
NEOPIX
  Top 0.203: U1.28 29.21,7.18 28.71,7.68 LED1.1
NEOPIX_PWR
  Top 0.203: U1.25 30.95,9.73 30.45,9.22 30.45,8.06 30.19,7.8 LED1.2
RESET  (via drill 0.5)
  Top 0.203: JP1.16 7.18,1.27 8.74,2.84 SW2.B' SW2.B 14.08,4.34 C4.1 15.7,4.43 R1.1 15.75,3.68 17.04,2.4 31.03,2.4 v31.68,3.05 | v42.93,3.07 43.84,3.07 44.28,3.52 U1.45
  Bottom 0.203: v31.68,3.05 31.68,3.38 32.08,3.78 42.22,3.78 v42.93,3.07
RX
  Top 0.254: U1.34 34.94,3.29 35.81,2.41 37.47,2.41 38.61,1.27 JP1.3
SCK
  Top 0.254: U1.32 33.55,4.11 33.55,2.56 32.26,1.27 JP1.6
SCL  (via drill 0.5)
  Top 0.203: IC1.C2 24.86,16.38 25.04,16.48 | 25.04,16.48 25.17,16.55 25.07,16.65 24.49,16.65 24.73,16.42 R6.2 | CONN1.4 24.67,13.31 24.67,14.91 v24.99,15.23 | 25.04,16.48 25.04,15.23 v24.99,15.23 | U1.8 38.35,18.41 v38.35,17.27 | U4.4 26.03,12.85 26.67,13.49 26.67,14.68 26.37,14.98 25.24,14.98 v24.99,15.23
  Top 0.254: U1.8 38.34,19.67 38.72,20.05 40.27,20.05 41.8,21.59 JP3.11
  Bottom 0.203: v38.35,17.27 37.24,18.39 29.29,18.39 26.13,15.23 v24.99,15.23
SDA  (via drill 0.5)
  Top 0.203: CONN1.3 23.25,11.93 23.11,12.06 23.11,13.34 23.75,13.97 v23.88,13.97 23.88,14.46 24.1,14.68 24.1,15.4 IC1.C1 | U1.7 39.19,17.71 v39.62,17.27 | R3.2 25.44,13.72 25.44,12.23 25.14,11.93 CONN1.3 | CONN1.3 24.37,12.01 U4.3
  Top 0.254: U1.7 39.19,19.22 39.31,19.34 41.03,19.34 42.12,20.43 42.66,20.43 43.81,21.59 JP3.12
  Bottom 0.203: v23.88,13.97 25.65,13.97 29.67,17.98 36.61,17.98 38.05,16.54 38.89,16.54 v39.62,17.27
TX
  Top 0.254: U1.35 35.78,3.28 36.2,2.87 37.78,2.87 38.23,2.43 40.75,2.43 JP1.2
TXD0
  Top 0.203: U1.39 39.19,3.23 39.5,2.92 41.82,2.92 42.41,2.34 43.38,2.34 JP1.1
VBAT
  Top 0.203: IC1.A3 22.14,16.88 21.01,15.75 20.95,15.75 20.82,15.75
  Top 0.305: Q3.3 11.48,11.59 11.48,14.02 11.81,14.35 11.81,15.56 X1.2 | U3.3 20.17,14.96 20.95,15.75 | 20.82,15.75 C3.1
  Top 0.406: X1.2 11.92,17.38 12.57,18.03 15.75,18.03 16.51,18.8 16.76,18.8 | U3.3 19.06,15.67 17.94,16.79 17.94,18.31 17.59,18.67 16.76,18.67 16.76,18.8 | JP3.1 16.76,21.34 16.76,18.8
VBUS  (via drill 0.5)
  Top 0.203: CHG.A 0.71,5.71 1.27,6.28 4.23,6.28 4.23,6.63 | 4.23,9.48 4.23,6.63 | R12.2 5.2,5.66 4.23,6.63
  Top 0.254: X3.B4A9 5.64,9.03 5.43,9.25 4.47,9.25 4.23,9.48 4.19,9.53 4.19,12.38 5.64,13.83 X3.A4B9
  Top 0.305: X3.A4B9 6.85,13.83 8.24,15.23 8.27,15.23 v8.52,15.48 8.84,15.16 8.84,12.88 9.63,12.09 D4.A 9.63,8.69 Q3.1
  Top 0.406: U3.4 19.06,18.15 v19.67,18.76 19.81,18.9 19.81,19.81 JP3.3
  Bottom 0.406: v19.67,18.76 18.19,17.27 13.21,17.27 11.42,15.48 v8.52,15.48
VHI
  Top 0.203: U2.1 14.6,9.64 14.86,9.91 18.29,9.91 19.32,8.88 R7.2
  Top 0.305: D4.C 12.94,11.6 C6.1 | C6.1 12.69,10.34 11.35,9 Q3.2 | C6.1 13.41,10.34 14.6,9.15 U2.1
VSENSOR
  Top 0.152: 28.07,10.71 U4.8
  Top 0.203: 26.86,11.49 26.73,11.36 U4.2 25.46,11.36 25.03,10.93 CONN1.2 | 26.86,11.49 27.38,12.01 U4.6 U4.5 | 26.86,11.49 27.64,10.71 28.07,10.71
  Top 0.254: 28.07,10.71 28.07,10.33 27.7,9.96 27.7,9.26 C11.1 27.27,8.55 26.26,7.54 Q1.3

### Text on the board
tPlace: SDA | BAT | EN | USB | 13 | 12 | 11 | 10 | 9 | 6 | 5 | SCL | #13 | I2C | Reset | Boot | Neo | Chg | RST | 3V | 3V | GND | A0 | A1 | A2 | A3 | A4 | A5 | SCK | MO | MI | RX | TX | DB
bPlace: 3.7/4.2V / LiPoly Batt / µUSB charge | EN | 13 | 12 | 11 | 10 | 9 | 6 | 5 | BAT | USB | SCL | SDA | ESP32-S2 F8 Feather / 240MHz Tensilica / WiFi Microcontroller / 4 MByte FLASH | RST | GND | SCK | 3V | 3V | A0 | A1 | A2 | A3 | A4 | A5 | MO | MI | RX | TX | Debug / TX